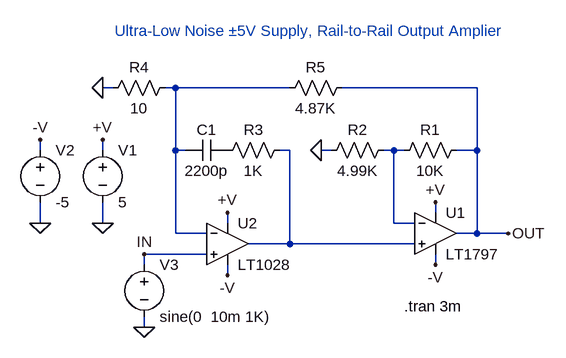
[diagram p0: schematic 1797.asc]
1797.asc, the LTspice schematic file:
Version 4
SHEET 1 896 680
WIRE -400 -48 -416 -48
WIRE -304 -48 -320 -48
WIRE -128 -48 -304 -48
WIRE 160 -48 -48 -48
WIRE -512 48 -512 32
WIRE -416 48 -416 32
WIRE -304 48 -304 -48
WIRE -288 48 -304 48
WIRE -128 48 -144 48
WIRE -64 48 -80 48
WIRE 32 48 16 48
WIRE 48 48 32 48
WIRE 160 48 160 -48
WIRE 160 48 128 48
WIRE 96 144 96 128
WIRE -512 160 -512 128
WIRE -416 160 -416 128
WIRE -224 160 -224 144
WIRE 32 160 32 48
WIRE 64 160 32 160
WIRE -304 176 -304 48
WIRE -256 176 -304 176
WIRE 160 176 160 48
WIRE 160 176 128 176
WIRE 208 176 160 176
WIRE -128 192 -128 48
WIRE -128 192 -192 192
WIRE 64 192 -128 192
WIRE -256 208 -352 208
WIRE -352 224 -352 208
WIRE 96 224 96 208
WIRE -224 240 -224 224
WIRE -352 320 -352 304
FLAG -416 160 0
FLAG 96 128 +V
FLAG -416 32 +V
FLAG 96 224 -V
FLAG -512 160 0
FLAG -512 32 -V
FLAG -80 48 0
FLAG -224 144 +V
FLAG -224 240 -V
FLAG -416 -48 0
FLAG -352 320 0
FLAG 208 176 OUT
FLAG -352 208 IN
SYMBOL voltage -416 32 R0
SYMATTR InstName V1
SYMATTR Value 5
SYMBOL voltage -512 32 R0
SYMATTR InstName V2
SYMATTR Value -5
SYMBOL res 144 32 R90
WINDOW 0 0 56 VBottom 0
WINDOW 3 32 56 VTop 0
SYMATTR InstName R1
SYMATTR Value 10K
SYMBOL res 32 32 R90
WINDOW 0 0 56 VBottom 0
WINDOW 3 32 56 VTop 0
SYMATTR InstName R2
SYMATTR Value 4.99K
SYMBOL opamps\\LT1797 96 112 R0
SYMATTR InstName U1
SYMBOL opamps\\LT1028 -224 128 R0
SYMATTR InstName U2
SYMBOL res -128 32 R90
WINDOW 0 0 56 VBottom 0
WINDOW 3 32 56 VTop 0
SYMATTR InstName R3
SYMATTR Value 1K
SYMBOL cap -224 32 R90
WINDOW 0 0 32 VBottom 0
WINDOW 3 32 32 VTop 0
SYMATTR InstName C1
SYMATTR Value 2200p
SYMBOL res -304 -64 R90
WINDOW 0 0 56 VBottom 0
WINDOW 3 32 56 VTop 0
SYMATTR InstName R4
SYMATTR Value 10
SYMBOL voltage -352 208 R0
SYMATTR InstName V3
SYMATTR Value sine(0  10m 1K)
SYMBOL res -32 -64 R90
WINDOW 0 0 56 VBottom 0
WINDOW 3 32 56 VTop 0
SYMATTR InstName R5
SYMATTR Value 4.87K
SYMATTR SpiceLine tol=1 pwr=0.1
TEXT 48 288 Left 0 !.tran 3m
TEXT -96 -120 Bottom 0 ;Ultra-Low Noise ±5V Supply, Rail-to-Rail Output Amplier

The netlist it stands for:
* 1797.asc
V1 +V 0 5
V2 -V 0 -5
R1 OUT N003 10K
R2 N003 0 4.99K
XU1 N002 N003 +V -V OUT LT1797  ; pins In+ In- V+ V- OUT
XU2 IN N001 +V -V N002 LT1028  ; pins In+ In- V+ V- OUT
R3 N002 P001 1K
C1 P001 N001 2200p
R4 N001 0 10
V3 IN 0 sine(0  10m 1K)
R5 OUT N001 4.87K tol=1 pwr=0.1
.tran 3m
* Ultra-Low Noise ±5V Supply, Rail-to-Rail Output Amplier
.lib LTC.lib
.backanno
.end